# EAGLE design adapter_#1HVPP (EAGLE 5.04)
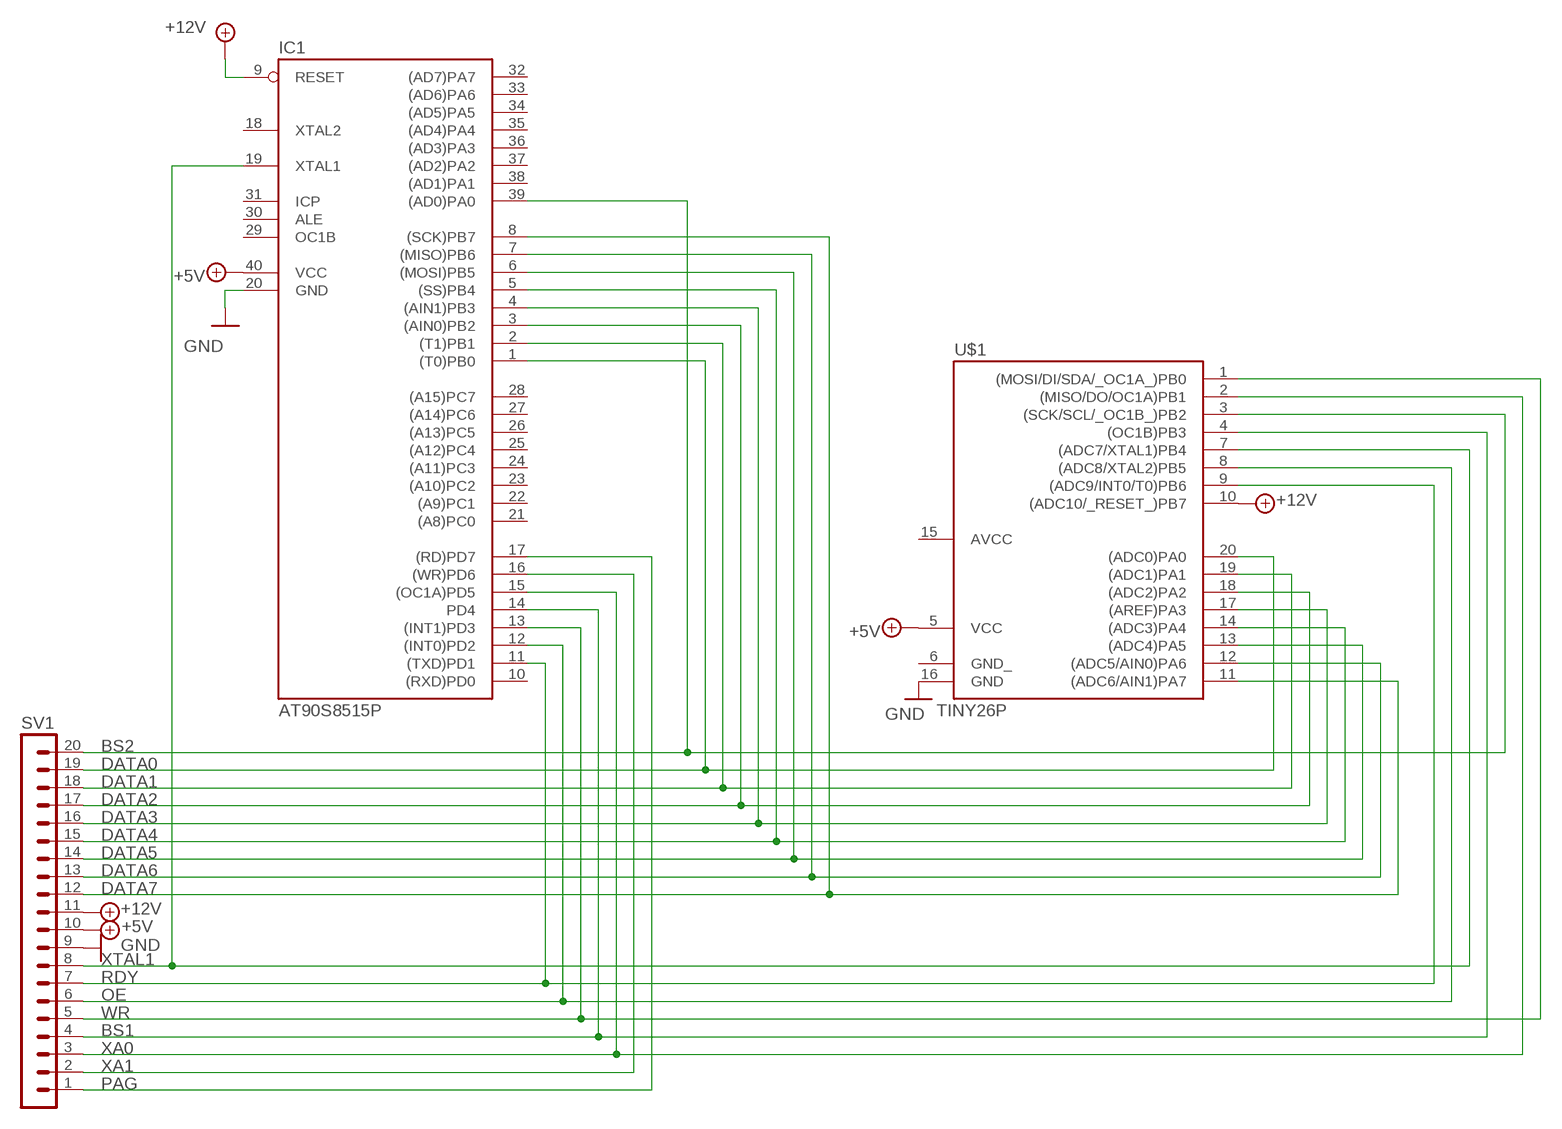
[diagram p0: schematic, sheet 1]

## Parts
IC1  AT90S8515P  [DIL40]
SV1  MA20-1  [MA20-1]
U$1  TINY26P  [DIL20]

## Nets
+5V: IC1.40(VCC) SV1.10 U$1.5(VCC)
+12V: IC1.9(RESET) SV1.11 U$1.10((ADC10/_RESET_)PB7)
BS1: IC1.14(PD4) SV1.4 U$1.4((OC1B)PB3)
BS2: IC1.39((AD0)PA0) SV1.20 U$1.3((SCK/SCL/_OC1B_)PB2)
DATA0: IC1.1((T0)PB0) SV1.19 U$1.20((ADC0)PA0)
DATA1: IC1.2((T1)PB1) SV1.18 U$1.19((ADC1)PA1)
DATA2: IC1.3((AIN0)PB2) SV1.17 U$1.18((ADC2)PA2)
DATA3: IC1.4((AIN1)PB3) SV1.16 U$1.17((AREF)PA3)
DATA4: IC1.5((SS)PB4) SV1.15 U$1.14((ADC3)PA4)
DATA5: IC1.6((MOSI)PB5) SV1.14 U$1.13((ADC4)PA5)
DATA6: IC1.7((MISO)PB6) SV1.13 U$1.12((ADC5/AIN0)PA6)
DATA7: IC1.8((SCK)PB7) SV1.12 U$1.11((ADC6/AIN1)PA7)
GND: IC1.20(GND) SV1.9 U$1.16(GND)
OE: IC1.12((INT0)PD2) SV1.6 U$1.8((ADC8/XTAL2)PB5)
PAG: IC1.17((RD)PD7) SV1.1
RDY: IC1.11((TXD)PD1) SV1.7 U$1.9((ADC9/INT0/T0)PB6)
WR: IC1.13((INT1)PD3) SV1.5 U$1.1((MOSI/DI/SDA/_OC1A_)PB0)
XA0: IC1.15((OC1A)PD5) SV1.3 U$1.2((MISO/DO/OC1A)PB1)
XA1: IC1.16((WR)PD6) SV1.2
XTAL1: IC1.19(XTAL1) SV1.8 U$1.7((ADC7/XTAL1)PB4)
Unconnected: IC1.10((RXD)PD0) IC1.18(XTAL2) IC1.21((A8)PC0) IC1.22((A9)PC1) IC1.23((A10)PC2) IC1.24((A11)PC3) IC1.25((A12)PC4) IC1.26((A13)PC5) IC1.27((A14)PC6) IC1.28((A15)PC7) IC1.29(OC1B) IC1.30(ALE) IC1.31(ICP) IC1.32((AD7)PA7) IC1.33((AD6)PA6) IC1.34((AD5)PA5) IC1.35((AD4)PA4) IC1.36((AD3)PA3) IC1.37((AD2)PA2) IC1.38((AD1)PA1)

## Power pins joined to a net without a drawn wire
AVCC: U$1.15(AVCC)
GND_: U$1.6(GND_)

## Library data of the parts
IC1 = avr-4:AT90S8515P: MICROCONTROLLER 8 Kbytes FLASH 512 bytes SRAM 512 bytes EEPROM UART
SV1 = con-lstb:MA20-1: PIN HEADER
U$1 = avr-4:TINY26

## Board
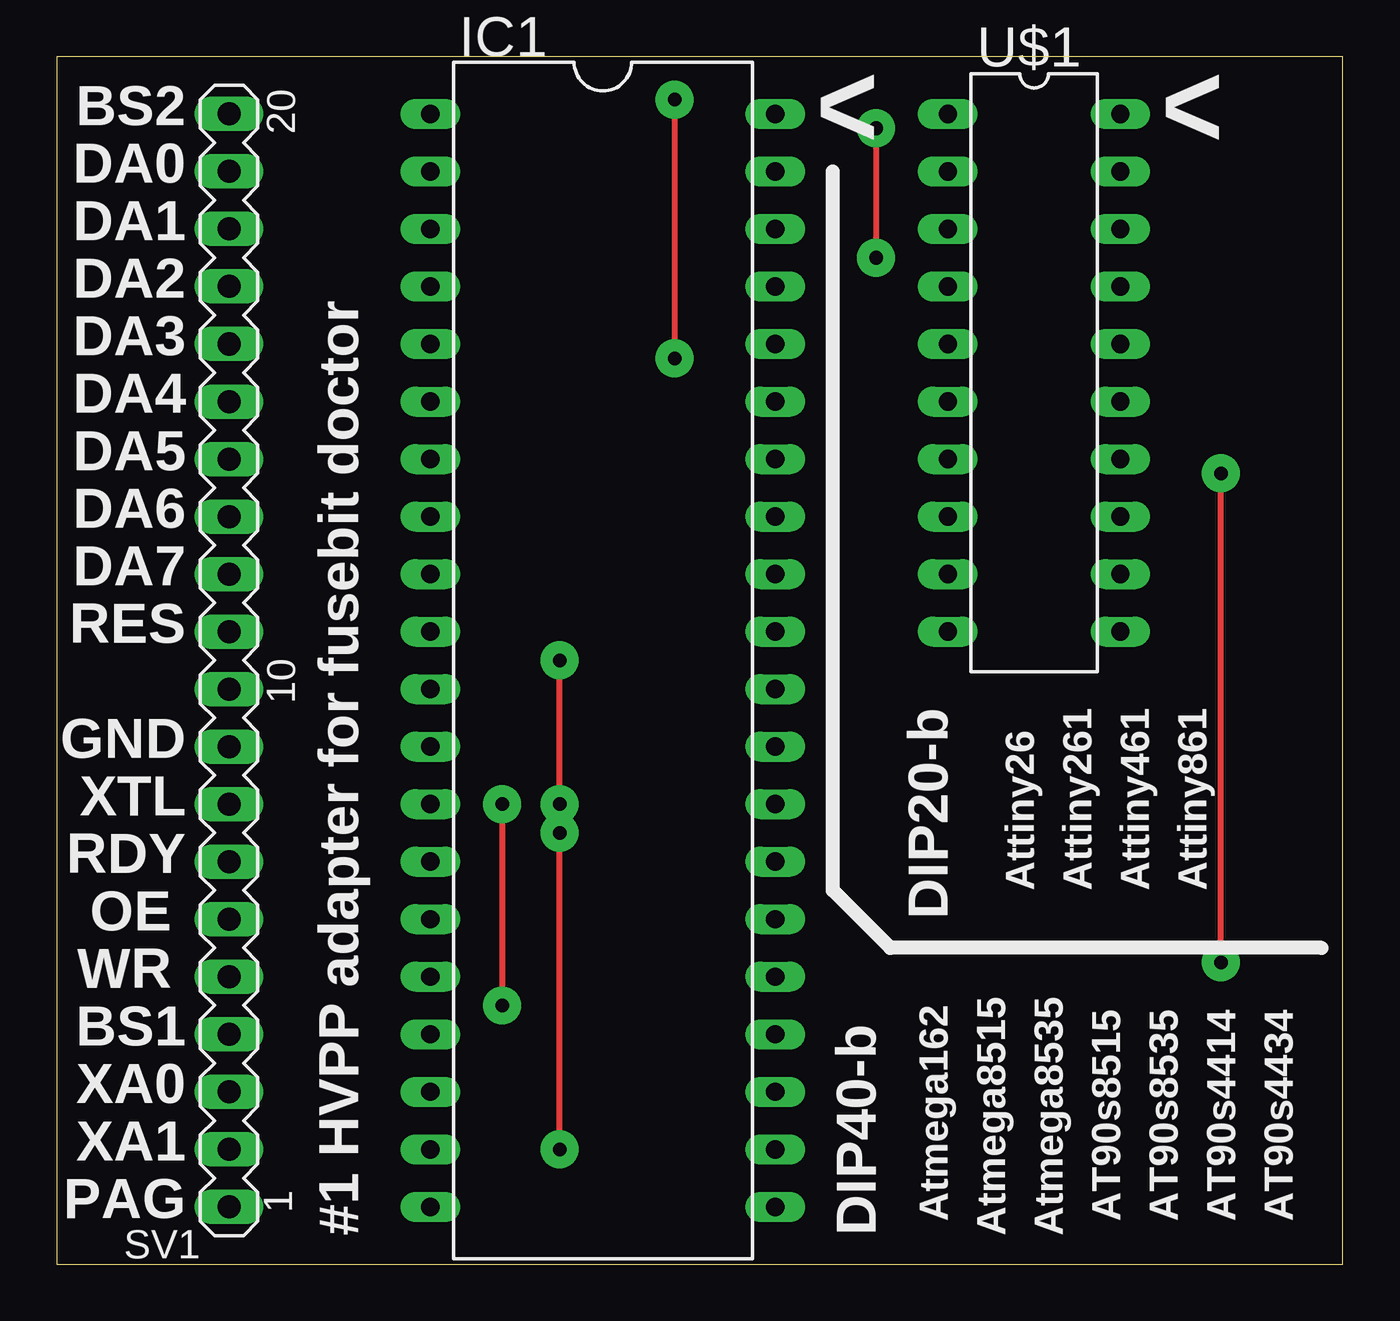
[diagram p1: board, top side]
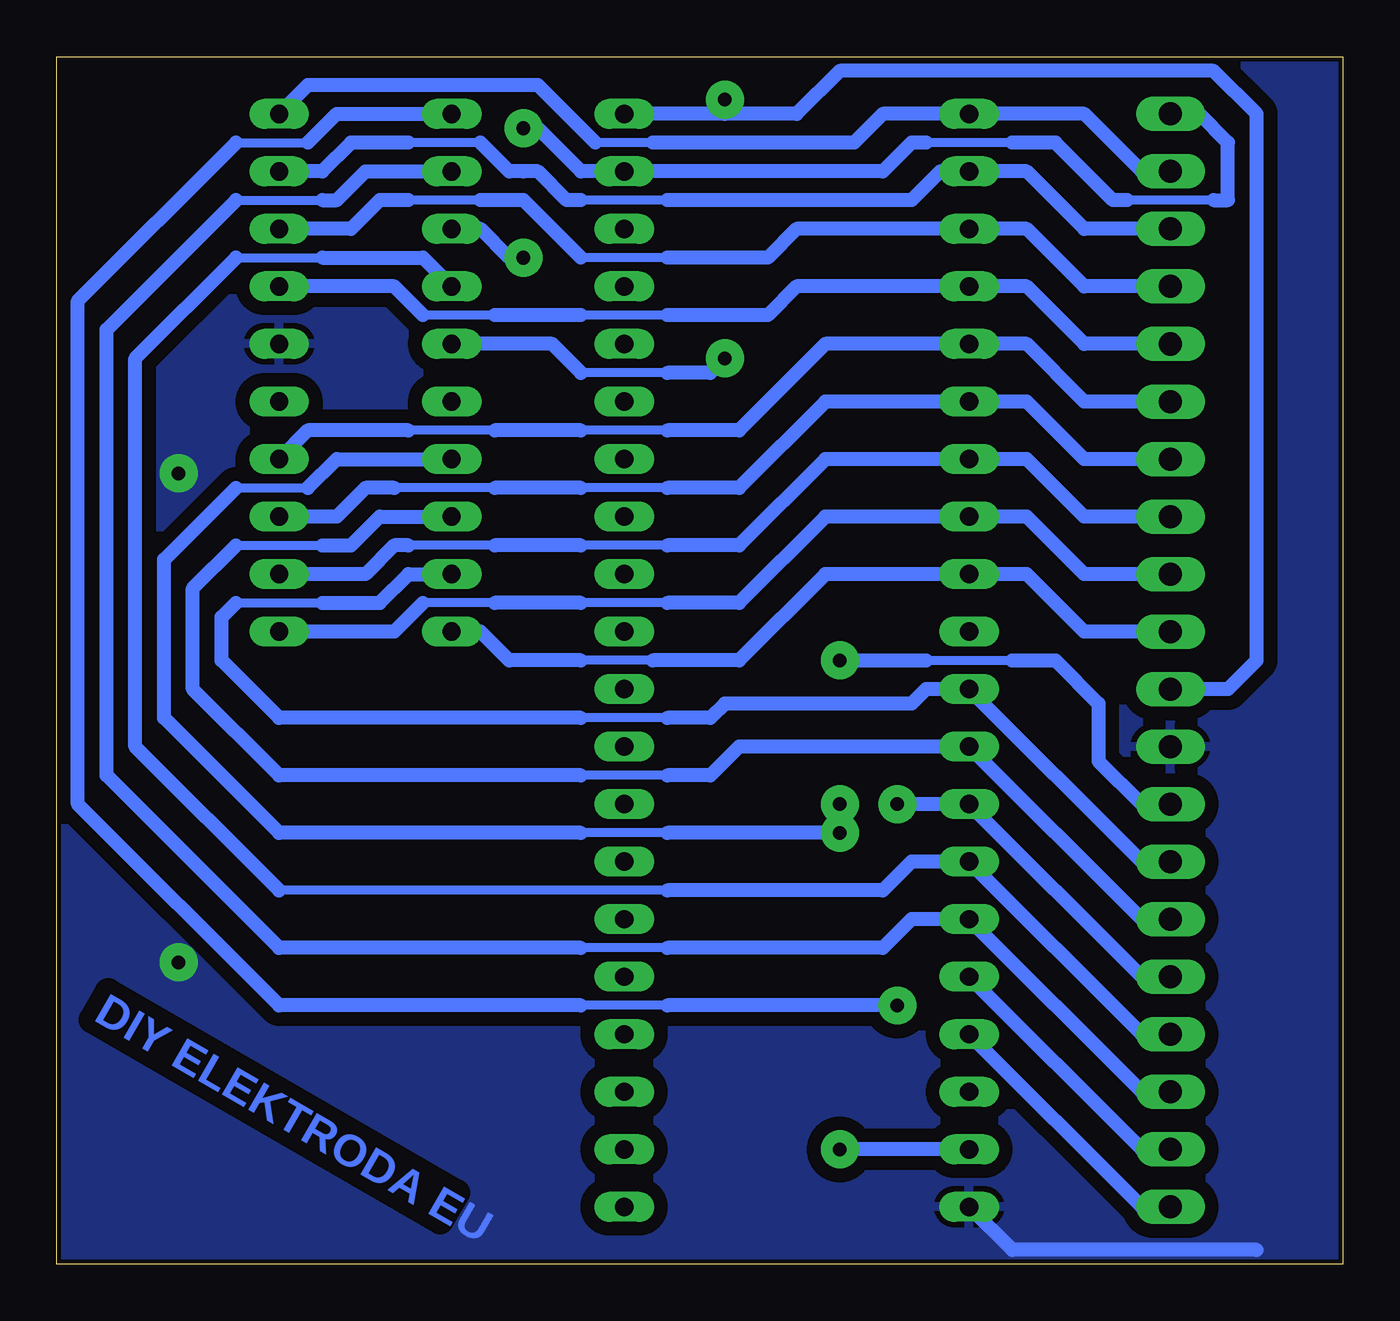
[diagram p2: board, bottom side, seen from below]

Size 56.82 x 53.33 mm. Coordinates in mm from the lower left corner, seen from the top.
Outline: 0,0 56.82,0 56.82,53.33 0,53.33 0,0
Copper layers (1*16): Top 0.035mm / dielectric 1.5mm / Bottom 0.035mm
Design rules "default *": minimum track width 10mil, minimum drill 24mil, track to track 24mil, track to pad 24mil, pad to pad 8mil, via to via 8mil, smd to smd 8mil, copper to edge 8mil, drill to drill 8mil, minimum pad ring 10mil, minimum via ring 8mil, stop-mask expansion 4mil, vias tented up to drill 0mil, thermal gap 10mil

### Footprints (pad centres in the part's own frame; a part is rotated, then mirrored left to right if it is on the bottom)
DIL40 = drill 0.813 long: 1 -24.13,-7.62; 2 -21.59,-7.62; 3 -19.05,-7.62; 4 -16.51,-7.62; 5 -13.97,-7.62; 6 -11.43,-7.62; 7 -8.89,-7.62; 8 -6.35,-7.62; 9 -3.81,-7.62; 10 -1.27,-7.62; 11 1.27,-7.62; 12 3.81,-7.62; 13 6.35,-7.62; 14 8.89,-7.62; 15 11.43,-7.62; 16 13.97,-7.62; 17 16.51,-7.62; 18 19.05,-7.62; 19 21.59,-7.62; 20 24.13,-7.62; 21 24.13,7.62; 22 21.59,7.62; 23 19.05,7.62; 24 16.51,7.62; 25 13.97,7.62; 26 11.43,7.62; 27 8.89,7.62; 28 6.35,7.62; 29 3.81,7.62; 30 1.27,7.62; 31 -1.27,7.62; 32 -3.81,7.62; 33 -6.35,7.62; 34 -8.89,7.62; 35 -11.43,7.62; 36 -13.97,7.62; 37 -16.51,7.62; 38 -19.05,7.62; 39 -21.59,7.62; 40 -24.13,7.62
MA20-1 = drill 1.016 long: 1 -24.13,0; 2 -21.59,0; 3 -19.05,0; 4 -16.51,0; 5 -13.97,0; 6 -11.43,0; 7 -8.89,0; 8 -6.35,0; 9 -3.81,0; 10 -1.27,0; 11 1.27,0; 12 3.81,0; 13 6.35,0; 14 8.89,0; 15 11.43,0; 16 13.97,0; 17 16.51,0; 18 19.05,0; 19 21.59,0; 20 24.13,0
DIL20 = drill 0.813 long: 1 -11.43,-3.81; 2 -8.89,-3.81; 3 -6.35,-3.81; 4 -3.81,-3.81; 5 -1.27,-3.81; 6 1.27,-3.81; 7 3.81,-3.81; 8 6.35,-3.81; 9 8.89,-3.81; 10 11.43,-3.81; 11 11.43,3.81; 12 8.89,3.81; 13 6.35,3.81; 14 3.81,3.81; 15 1.27,3.81; 16 -1.27,3.81; 17 -3.81,3.81; 18 -6.35,3.81; 19 -8.89,3.81; 20 -11.43,3.81

### Placement (x,y rotation side)
IC1  24.13,26.67 270 top
SV1  7.62,26.67 90 top
U$1  43.18,39.37 270 top

### Tracks (layer width: path | path; a pad name or v marks a point on that pad's centre or on a via)
+5V  (via drill 0.6 pad 1.68)
  Top 0.254: v27.3,51.44 v27.3,40.01
  Bottom 0.406: 29.84,39.37 33.66,39.37
  Bottom 0.61: SV1.10 5.08,25.4 3.81,26.67 3.81,50.8 5.71,52.7 22.23,52.7 24.13,50.8 27.3,50.8 | 27.3,50.8 IC1.40 | 27.3,50.8 v27.3,51.44 | U$1.5 34.92,40.64 33.66,39.37 | 29.84,39.37 27.94,39.37 v27.3,40.01
+12V
  Bottom 0.406: 30.48,26.67 33.66,26.67
  Bottom 0.61: SV1.11 11.43,27.94 13.97,30.48 IC1.9 22.86,30.48 26.67,26.67 30.48,26.67 | 33.66,26.67 36.83,26.67 38.1,27.94 U$1.10
BS1
  Bottom 0.406: 48.9,44.45 45.09,44.45 | 29.84,16.51 46.99,16.51
  Bottom 0.61: SV1.4 8.89,10.16 IC1.14 19.05,17.78 20.32,16.51 29.84,16.51 | U$1.4 40.64,44.45 45.09,44.45 | 48.9,44.45 53.34,40.01 53.34,22.86 46.99,16.51
BS2  (via drill 0.6 pad 1.68)
  Top 0.254: v36.2,50.16 v36.2,44.45
  Bottom 0.406: 5.71,46.99 9.53,46.99 | 14.61,49.53 18.41,49.53
  Bottom 0.61: SV1.20 6.35,50.8 5.08,49.53 5.08,46.99 5.71,46.99 | 9.53,46.99 10.16,46.99 12.7,49.53 14.61,49.53 | 18.41,49.53 19.05,49.53 20.32,48.26 IC1.39 33.66,48.26 35.56,50.16 v36.2,50.16 | U$1.3 38.1,45.72 36.83,44.45 v36.2,44.45
DATA0
  Bottom 0.406: 30.48,49.53 33.02,49.53
  Bottom 0.61: SV1.19 8.89,48.26 11.43,50.8 IC1.1 20.32,50.8 21.59,49.53 30.48,49.53 | 33.02,49.53 35.56,52.07 45.72,52.07 U$1.20
DATA1
  Bottom 0.406: 29.84,46.99 33.66,46.99 | 38.1,49.53 41.27,49.53
  Bottom 0.61: SV1.18 11.43,45.72 13.97,48.26 IC1.2 17.78,48.26 19.05,46.99 29.84,46.99 | 33.66,46.99 34.29,46.99 35.56,48.26 36.2,48.26 36.83,48.26 38.1,49.53 | 41.27,49.53 43.81,49.53 45.09,48.26 U$1.19
DATA2
  Bottom 0.406: 29.84,44.45 33.66,44.45 | 38.1,46.99 41.27,46.99
  Bottom 0.61: SV1.17 11.43,43.18 13.97,45.72 IC1.3 24.13,45.72 25.4,44.45 29.84,44.45 | 33.66,44.45 36.2,46.99 38.1,46.99 | 41.27,46.99 42.55,46.99 43.81,45.72 U$1.18
DATA3
  Bottom 0.406: 29.84,41.91 33.66,41.91 | 37.47,41.91 40.64,41.91
  Bottom 0.61: SV1.16 11.43,40.64 13.97,43.18 IC1.4 24.13,43.18 25.4,41.91 29.84,41.91 | 40.64,41.91 41.91,43.18 U$1.17 | 33.66,41.91 37.47,41.91
DATA4
  Bottom 0.406: 29.84,36.83 33.66,36.83 | 37.47,36.83 41.27,36.83
  Bottom 0.61: SV1.15 11.43,38.1 13.97,40.64 IC1.5 22.86,40.64 26.67,36.83 29.84,36.83 | 41.27,36.83 45.72,36.83 U$1.14 | 33.66,36.83 37.47,36.83
DATA5
  Bottom 0.406: 29.84,34.29 33.66,34.29 | 37.47,34.29 41.91,34.29
  Bottom 0.61: SV1.14 11.43,35.56 13.97,38.1 IC1.6 22.86,38.1 26.67,34.29 29.84,34.29 | 41.91,34.29 43.18,34.29 44.45,33.02 U$1.13 | 33.66,34.29 37.47,34.29
DATA6
  Bottom 0.406: 29.84,31.75 33.66,31.75 | 37.47,31.75 41.27,31.75
  Bottom 0.61: SV1.13 11.43,33.02 13.97,35.56 IC1.7 22.86,35.56 26.67,31.75 29.84,31.75 | 41.27,31.75 41.91,31.75 43.18,30.48 U$1.12 | 33.66,31.75 37.47,31.75
DATA7
  Bottom 0.406: 29.84,29.21 33.66,29.21 | 37.47,29.21 40.64,29.21
  Bottom 0.61: SV1.12 11.43,30.48 13.97,33.02 IC1.8 22.86,33.02 26.67,29.21 29.84,29.21 | 40.64,29.21 41.91,27.94 U$1.11 | 33.66,29.21 37.47,29.21
GND  (via drill 0.6 pad 1.68)
  Top 0.254: v51.44,13.34 v51.44,34.92
  Bottom 0.61: IC1.20 14.61,0.64 3.81,0.64
  pour Bottom: 0,53.34 56.52,53.34 56.52,0 0,0
OE
  Bottom 0.406: 48.9,31.75 45.09,31.75 | 29.84,21.59 33.66,21.59
  Bottom 0.61: SV1.6 8.89,15.24 IC1.12 26.67,22.86 27.94,21.59 29.84,21.59 | U$1.8 42.55,33.02 43.81,31.75 45.09,31.75 | 48.9,31.75 50.8,29.84 50.8,25.4 46.99,21.59 33.66,21.59
PAG
  Bottom 0.61: SV1.1 8.89,2.54 IC1.17
RDY
  Bottom 0.406: 48.9,29.21 45.09,29.21 | 29.84,24.13 33.66,24.13
  Bottom 0.61: SV1.7 8.89,17.78 IC1.11 18.41,25.4 19.05,24.77 27.3,24.77 27.94,24.13 29.84,24.13 | U$1.9 41.27,30.48 42.55,29.21 45.09,29.21 | 48.9,29.21 49.53,28.57 49.53,26.67 46.99,24.13 33.66,24.13
WR  (via drill 0.6 pad 1.68)
  Top 0.254: v19.68,20.32 v19.68,11.43
  Bottom 0.406: 48.9,49.53 45.72,49.53 | 29.84,11.43 33.66,11.43
  Bottom 0.61: SV1.5 8.89,12.7 IC1.13 v19.68,20.32 | U$1.1 44.45,50.8 45.72,49.53 | 48.9,49.53 55.88,42.55 55.88,20.32 46.99,11.43 33.66,11.43 | v19.68,11.43 29.84,11.43
XA0
  Bottom 0.406: 48.9,46.99 45.09,46.99 | 29.84,13.97 33.66,13.97
  Bottom 0.61: SV1.3 8.89,7.62 IC1.15 19.05,15.24 20.32,13.97 29.84,13.97 | U$1.2 43.18,48.26 44.45,46.99 45.09,46.99 | 48.9,46.99 54.61,41.27 54.61,21.59 46.99,13.97 33.66,13.97
XA1
  Bottom 0.61: SV1.2 8.89,5.08 IC1.16
XTAL1  (via drill 0.6 pad 1.68)
  Top 0.254: v22.23,5.08 v22.23,19.05 v22.23,20.32 v22.23,26.67
  Bottom 0.406: 18.41,26.67 14.61,26.67 | 48.9,34.29 45.72,34.29 | 29.84,19.05 33.66,19.05
  Bottom 0.61: SV1.8 8.89,20.32 10.79,22.23 10.79,24.77 12.7,26.67 14.61,26.67 | v22.23,26.67 18.41,26.67 | IC1.19 v22.23,5.08 | U$1.7 44.45,35.56 45.72,34.29 | 48.9,34.29 52.07,31.11 52.07,24.13 46.99,19.05 33.66,19.05 | v22.23,19.05 29.84,19.05

### Text on the board
Bottom: DIY ELEKTRODA EU
tPlace: BS2 | DA0 | ^ | ^ | DA1 | DA2 | DA3 | DA4 | DA5 | DA6 | DA7 | RES | GND | XTL | RDY | OE | Attiny26 | Attiny261 | Attiny461 | Attiny861 | DIP20-b | WR | BS1 | XA0 | XA1 | PAG | Atmega162 | AT90s8515 | AT90s8535 | AT90s4414 | AT90s4434 | #1 HVPP adapter for fusebit doctor | DIP40-b | Atmega8515 | Atmega8535